# EAGLE schematic FootPlate_v1 (EAGLE 9.0.0)

## Sheet 1 of 5
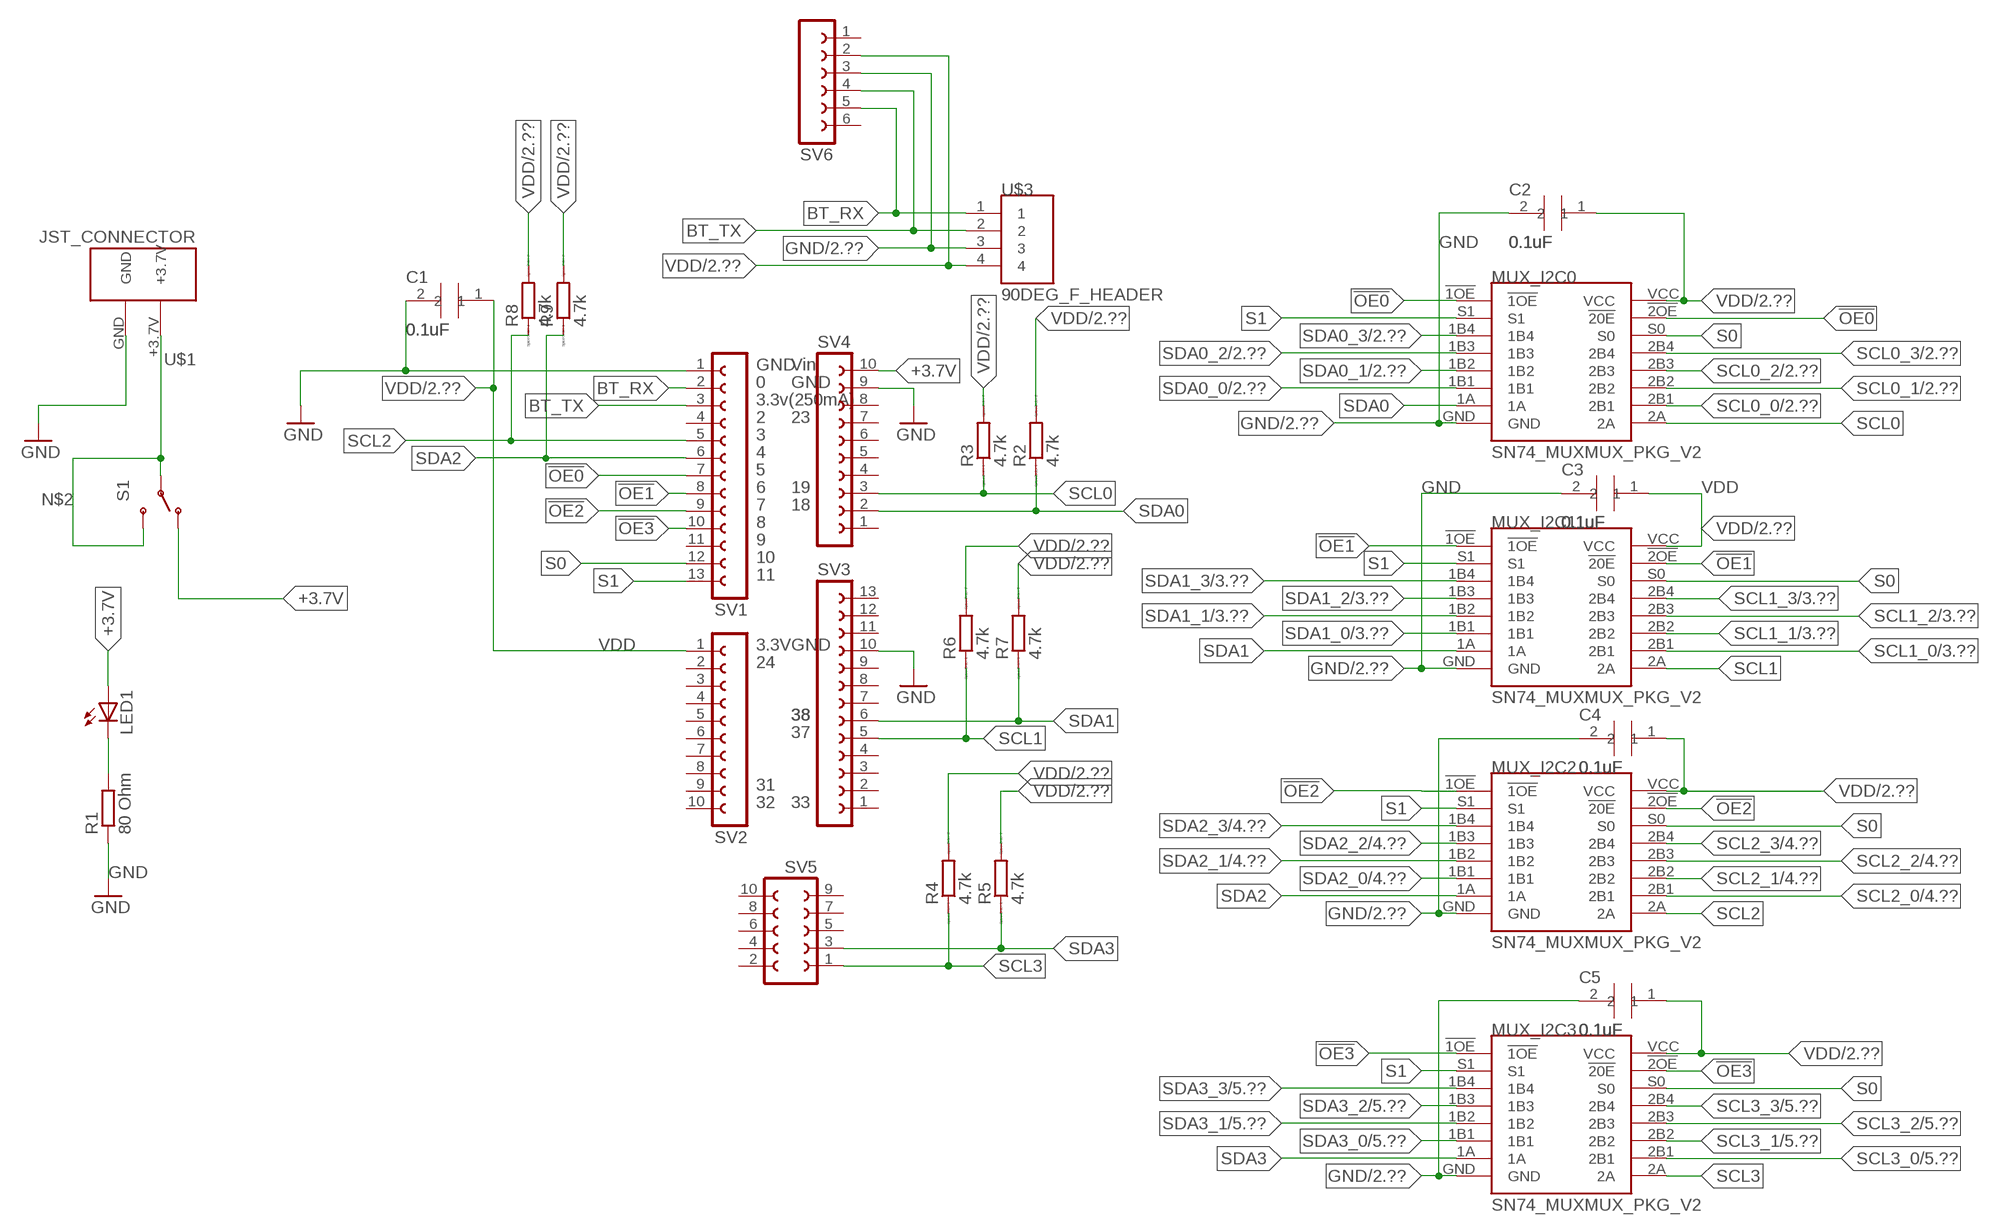
[diagram p0: schematic, sheet 1]

### Parts
C1  0.1uF  CAP  [CAPC1608X75]
C2  0.1uF  CAP  [CAPC1608X75]
C3  0.1uF  CAP  [CAPC1608X75]
C4  0.1uF  CAP  [CAPC1608X75]
C5  0.1uF  CAP  [CAPC1608X75]
LED1  LEDSMT1206  [1206]
MUX_I2C0  SN74_MUXMUX_PKG_V2  [SOP65P640X120-16]
MUX_I2C1  SN74_MUXMUX_PKG_V2  [SOP65P640X120-16]
MUX_I2C2  SN74_MUXMUX_PKG_V2  [SOP65P640X120-16]
MUX_I2C3  SN74_MUXMUX_PKG_V2  [SOP65P640X120-16]
R1  80 Ohm  R-EU_M1206  [M1206]
R2  4.7k  RR1206  [R1206]
R3  4.7k  RR1206  [R1206]
R4  4.7k  RR1206  [R1206]
R5  4.7k  RR1206  [R1206]
R6  4.7k  RR1206  [R1206]
R7  4.7k  RR1206  [R1206]
R8  4.7k  RR1206  [R1206]
R9  4.7k  RR1206  [R1206]
S1  SWITCH_SPDT  [SWITCH]
SV1  FE13-1  [FE13]
SV2  FE10-1  [FE10]
SV3  FE13-1  [FE13]
SV4  FE10-1  [FE10]
SV5  FE05-2  [FE05-2]
SV6  FE06-1  [FE06]
U$1  JST_CONNECTOR  [JST_PKG]
U$3  90DEG_F_HEADER  [90DEG_F_HEADER_PKG]

### Nets
!OE0: MUX_I2C0.!1OE MUX_I2C0.!2OE(!20E) SV1.7
!OE1: MUX_I2C1.!1OE MUX_I2C1.!2OE(!20E) SV1.8
!OE2: MUX_I2C2.!1OE MUX_I2C2.!2OE(!20E) SV1.9
!OE3: MUX_I2C3.!1OE MUX_I2C3.!2OE(!20E) SV1.10
+3.7V: LED1.A S1.1(O) SV4.10
BT_RX: SV1.2 SV6.5 U$3.1
BT_TX: SV1.3 SV6.4 U$3.2
GND: C1.2 C2.2 C3.2 C4.2 C5.2 MUX_I2C0.GND MUX_I2C1.GND MUX_I2C2.GND MUX_I2C3.GND R1.1 SV1.1 SV3.10 SV4.9 SV6.3 U$1.GND U$3.3 ; also sheet 2,3,4,5
N$1: LED1.C R1.2
N$2: S1.2(P) S1.3(S) U$1.+3.7V
S0: MUX_I2C0.S0 MUX_I2C1.S0 MUX_I2C2.S0 MUX_I2C3.S0 SV1.12
S1: MUX_I2C0.S1 MUX_I2C1.S1 MUX_I2C2.S1 MUX_I2C3.S1 SV1.13
SCL0: MUX_I2C0.2A R3.1 SV4.3
SCL0_0: MUX_I2C0.2B1 ; also sheet 2
SCL0_1: MUX_I2C0.2B2 ; also sheet 2
SCL0_2: MUX_I2C0.2B3 ; also sheet 2
SCL0_3: MUX_I2C0.2B4 ; also sheet 2
SCL1: MUX_I2C1.2A R6.1 SV3.5
SCL1_0: MUX_I2C1.2B1 ; also sheet 3
SCL1_1: MUX_I2C1.2B2 ; also sheet 3
SCL1_2: MUX_I2C1.2B3 ; also sheet 3
SCL1_3: MUX_I2C1.2B4 ; also sheet 3
SCL2: MUX_I2C2.2A R8.1 SV1.5
SCL2_0: MUX_I2C2.2B1 ; also sheet 4
SCL2_1: MUX_I2C2.2B2 ; also sheet 4
SCL2_2: MUX_I2C2.2B3 ; also sheet 4
SCL2_3: MUX_I2C2.2B4 ; also sheet 4
SCL3: MUX_I2C3.2A R4.1 SV5.1
SCL3_0: MUX_I2C3.2B1 ; also sheet 5
SCL3_1: MUX_I2C3.2B2 ; also sheet 5
SCL3_2: MUX_I2C3.2B3 ; also sheet 5
SCL3_3: MUX_I2C3.2B4 ; also sheet 5
SDA0: MUX_I2C0.1A R2.1 SV4.2
SDA0_0: MUX_I2C0.1B1 ; also sheet 2
SDA0_1: MUX_I2C0.1B2 ; also sheet 2
SDA0_2: MUX_I2C0.1B3 ; also sheet 2
SDA0_3: MUX_I2C0.1B4 ; also sheet 2
SDA1: MUX_I2C1.1A R7.1 SV3.6
SDA1_0: MUX_I2C1.1B1 ; also sheet 3
SDA1_1: MUX_I2C1.1B2 ; also sheet 3
SDA1_2: MUX_I2C1.1B3 ; also sheet 3
SDA1_3: MUX_I2C1.1B4 ; also sheet 3
SDA2: MUX_I2C2.1A R9.1 SV1.6
SDA2_0: MUX_I2C2.1B1 ; also sheet 4
SDA2_1: MUX_I2C2.1B2 ; also sheet 4
SDA2_2: MUX_I2C2.1B3 ; also sheet 4
SDA2_3: MUX_I2C2.1B4 ; also sheet 4
SDA3: MUX_I2C3.1A R5.1 SV5.3
SDA3_0: MUX_I2C3.1B1 ; also sheet 5
SDA3_1: MUX_I2C3.1B2 ; also sheet 5
SDA3_2: MUX_I2C3.1B3 ; also sheet 5
SDA3_3: MUX_I2C3.1B4 ; also sheet 5
VDD: C1.1 C2.1 C3.1 C4.1 C5.1 MUX_I2C0.VCC MUX_I2C1.VCC MUX_I2C2.VCC MUX_I2C3.VCC R2.2 R3.2 R4.2 R5.2 R6.2 R7.2 R8.2 R9.2 SV2.1 SV6.2 U$3.4 ; also sheet 2,3,4,5
Unconnected: SV1.4 SV1.11 SV2.2 SV2.3 SV2.4 SV2.5 SV2.6 SV2.7 SV2.8 SV2.9 SV2.10 SV3.1 SV3.2 SV3.3 SV3.4 SV3.7 SV3.8 SV3.9 SV3.11 SV3.12 SV3.13 SV4.1 SV4.4 SV4.5 SV4.6 SV4.7 SV4.8 SV5.2 SV5.4 SV5.5 SV5.6 SV5.7 SV5.8 SV5.9 SV5.10 SV6.1 SV6.6

### Notes on the sheet
- GND | Vin
- 0 | GND
- 3.3v(250mA)
- 2 | 23
- 3
- 4
- 5
- 6 | 19
- 7 | 18
- 8
- 9
- 10
- 11
- 3.3V | GND
- 24
- 38 | 38
- 37
- 31
- 32 | 33

## Sheet 2 of 5
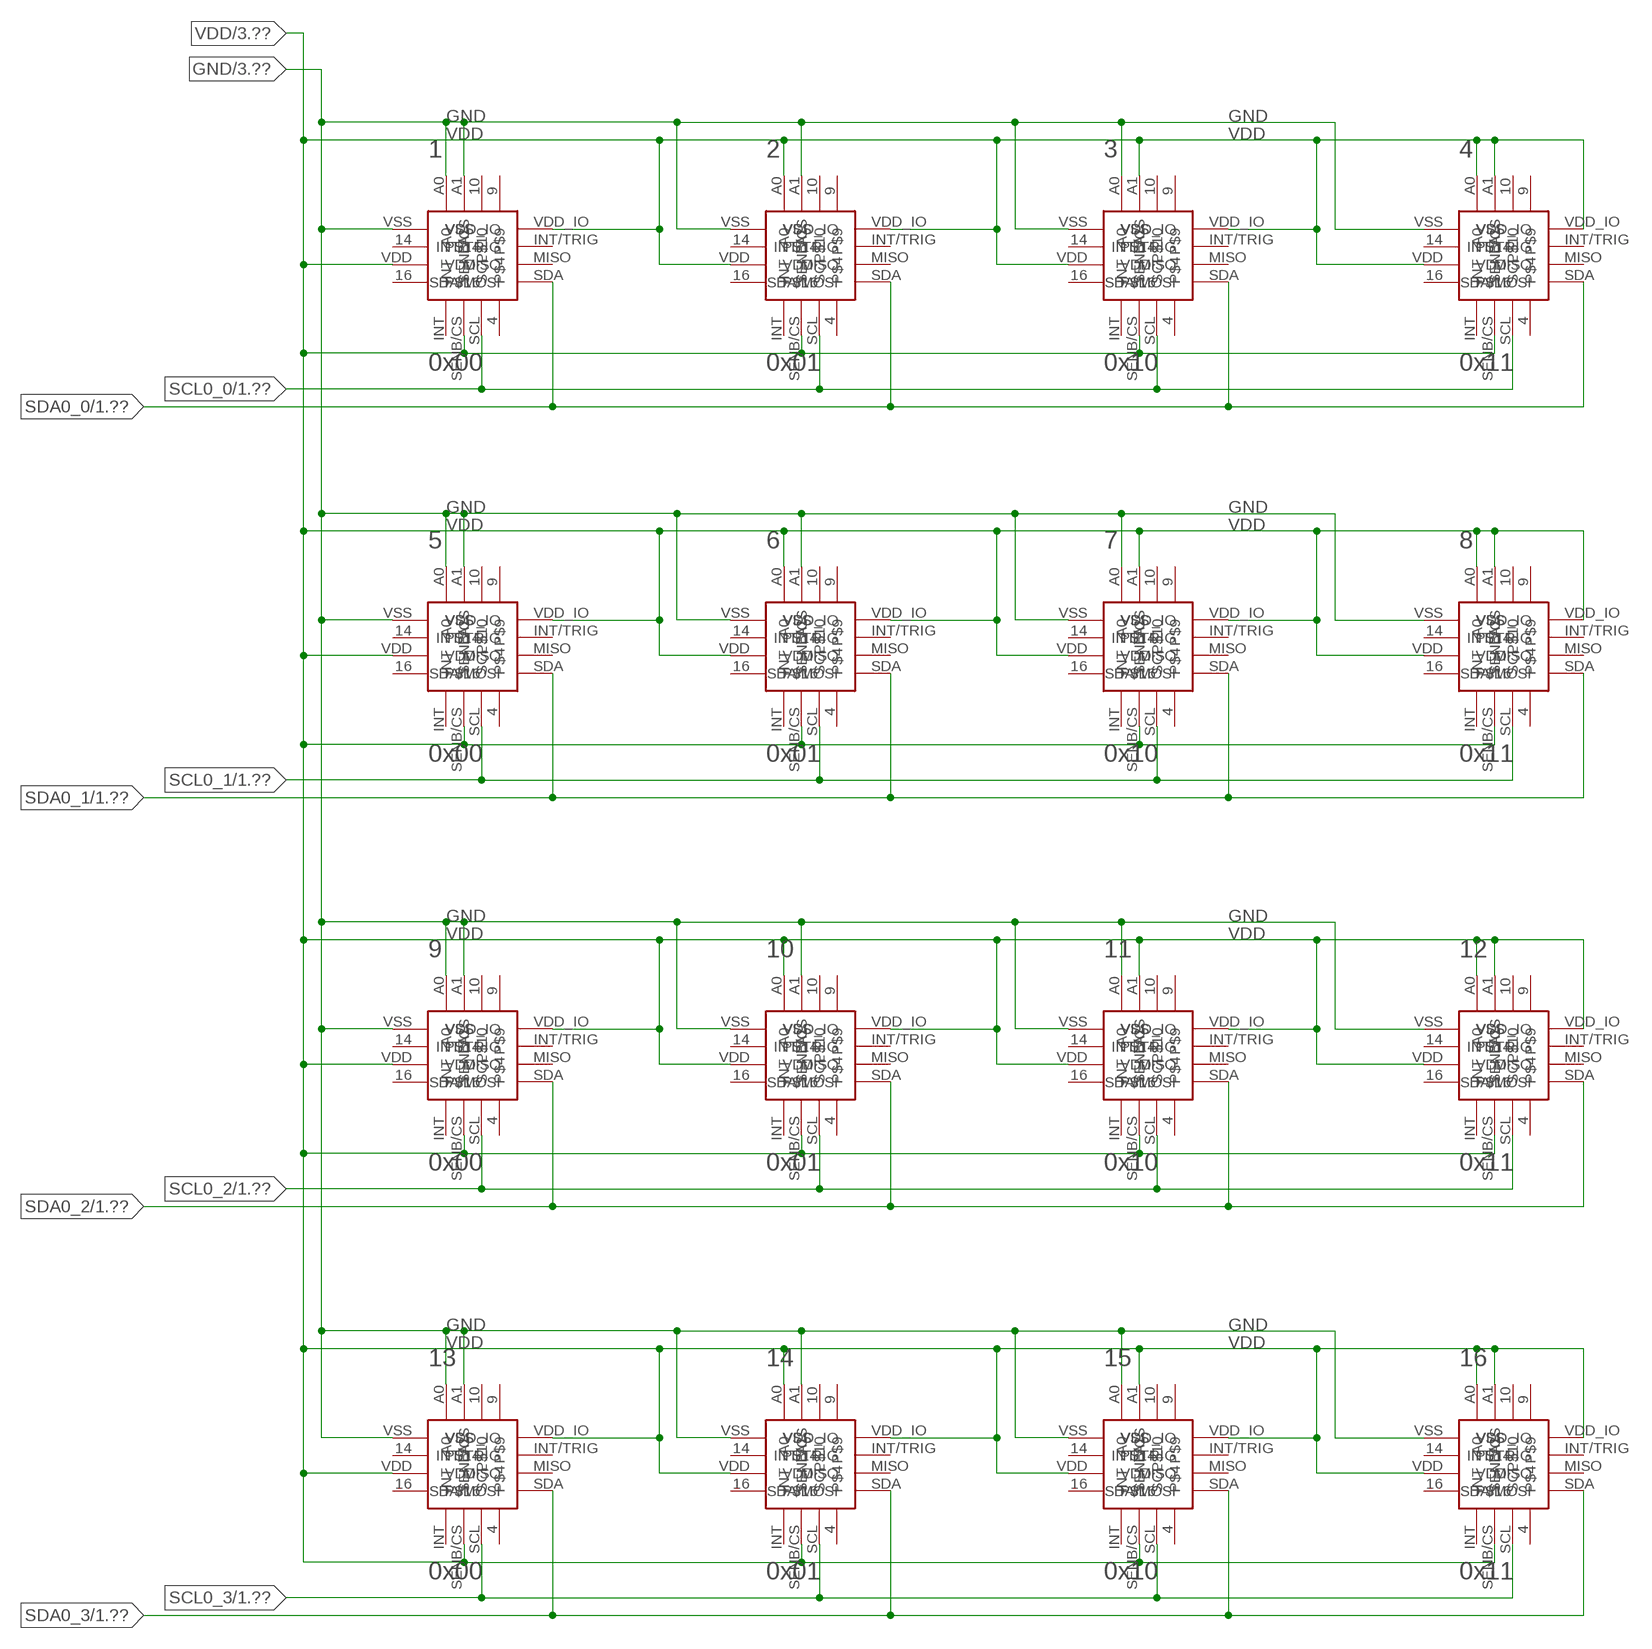
[diagram p1: schematic, sheet 2]

### Parts
1  0x00  ML90393_V2  [MLX90393_PKG]
2  0x01  ML90393_V2  [MLX90393_PKG]
3  0x10  ML90393_V2  [MLX90393_PKG]
4  0x11  ML90393_V2  [MLX90393_PKG]
5  0x00  ML90393_V2  [MLX90393_PKG]
6  0x01  ML90393_V2  [MLX90393_PKG]
7  0x10  ML90393_V2  [MLX90393_PKG]
8  0x11  ML90393_V2  [MLX90393_PKG]
9  0x00  ML90393_V2  [MLX90393_PKG]
10  0x01  ML90393_V2  [MLX90393_PKG]
11  0x10  ML90393_V2  [MLX90393_PKG]
12  0x11  ML90393_V2  [MLX90393_PKG]
13  0x00  ML90393_V2  [MLX90393_PKG]
14  0x01  ML90393_V2  [MLX90393_PKG]
15  0x10  ML90393_V2  [MLX90393_PKG]
16  0x11  ML90393_V2  [MLX90393_PKG]

### Nets
GND: 1.A0 1.A1 1.VSS 2.A1 2.VSS 3.A0 3.VSS 4.VSS 5.A0 5.A1 5.VSS 6.A1 6.VSS 7.A0 7.VSS 8.VSS 9.A0 9.A1 9.VSS 10.A1 10.VSS 11.A0 11.VSS 12.VSS 13.A0 13.A1 13.VSS 14.A1 14.VSS 15.A0 15.VSS 16.VSS ; also sheet 1,3,4,5
SCL0_0: 1.SCL 2.SCL 3.SCL 4.SCL ; also sheet 1
SCL0_1: 5.SCL 6.SCL 7.SCL 8.SCL ; also sheet 1
SCL0_2: 9.SCL 10.SCL 11.SCL 12.SCL ; also sheet 1
SCL0_3: 13.SCL 14.SCL 15.SCL 16.SCL ; also sheet 1
SDA0_0: 1.SDA(SDA/MOSI) 2.SDA(SDA/MOSI) 3.SDA(SDA/MOSI) 4.SDA(SDA/MOSI) ; also sheet 1
SDA0_1: 5.SDA(SDA/MOSI) 6.SDA(SDA/MOSI) 7.SDA(SDA/MOSI) 8.SDA(SDA/MOSI) ; also sheet 1
SDA0_2: 9.SDA(SDA/MOSI) 10.SDA(SDA/MOSI) 11.SDA(SDA/MOSI) 12.SDA(SDA/MOSI) ; also sheet 1
SDA0_3: 13.SDA(SDA/MOSI) 14.SDA(SDA/MOSI) 15.SDA(SDA/MOSI) 16.SDA(SDA/MOSI) ; also sheet 1
VDD: 1.SENB/CS 1.VDD 1.VDD_IO 2.A0 2.SENB/CS 2.VDD 2.VDD_IO 3.A1 3.SENB/CS 3.VDD 3.VDD_IO 4.A0 4.A1 4.SENB/CS 4.VDD 4.VDD_IO 5.SENB/CS 5.VDD 5.VDD_IO 6.A0 6.SENB/CS 6.VDD 6.VDD_IO 7.A1 7.SENB/CS 7.VDD 7.VDD_IO 8.A0 8.A1 8.SENB/CS 8.VDD 8.VDD_IO 9.SENB/CS 9.VDD 9.VDD_IO 10.A0 10.SENB/CS 10.VDD 10.VDD_IO 11.A1 11.SENB/CS 11.VDD 11.VDD_IO 12.A0 12.A1 12.SENB/CS 12.VDD 12.VDD_IO 13.SENB/CS 13.VDD 13.VDD_IO 14.A0 14.SENB/CS 14.VDD 14.VDD_IO 15.A1 15.SENB/CS 15.VDD 15.VDD_IO 16.A0 16.A1 16.SENB/CS 16.VDD 16.VDD_IO ; also sheet 1,3,4,5
Unconnected: 1.4 1.9 1.10 1.14 1.16 1.INT 1.INT/TRIG 1.MISO 2.4 2.9 2.10 2.14 2.16 2.INT 2.INT/TRIG 2.MISO 3.4 3.9 3.10 3.14 3.16 3.INT 3.INT/TRIG 3.MISO 4.4 4.9 4.10 4.14 4.16 4.INT 4.INT/TRIG 4.MISO 5.4 5.9 5.10 5.14 5.16 5.INT 5.INT/TRIG 5.MISO 6.4 6.9 6.10 6.14 6.16 6.INT 6.INT/TRIG 6.MISO 7.4 7.9 7.10 7.14 7.16 7.INT 7.INT/TRIG 7.MISO 8.4 8.9 8.10 8.14 8.16 8.INT 8.INT/TRIG 8.MISO 9.4 9.9 9.10 9.14 9.16 9.INT 9.INT/TRIG 9.MISO 10.4 10.9 10.10 10.14 10.16 10.INT 10.INT/TRIG 10.MISO 11.4 11.9 11.10 11.14 11.16 11.INT 11.INT/TRIG 11.MISO 12.4 12.9 12.10 12.14 12.16 12.INT 12.INT/TRIG 12.MISO 13.4 13.9 13.10 13.14 13.16 13.INT 13.INT/TRIG 13.MISO 14.4 14.9 14.10 14.14 14.16 14.INT 14.INT/TRIG 14.MISO 15.4 15.9 15.10 15.14 15.16 15.INT 15.INT/TRIG 15.MISO 16.4 16.9 16.10 16.14 16.16 16.INT 16.INT/TRIG 16.MISO

## Sheet 3 of 5
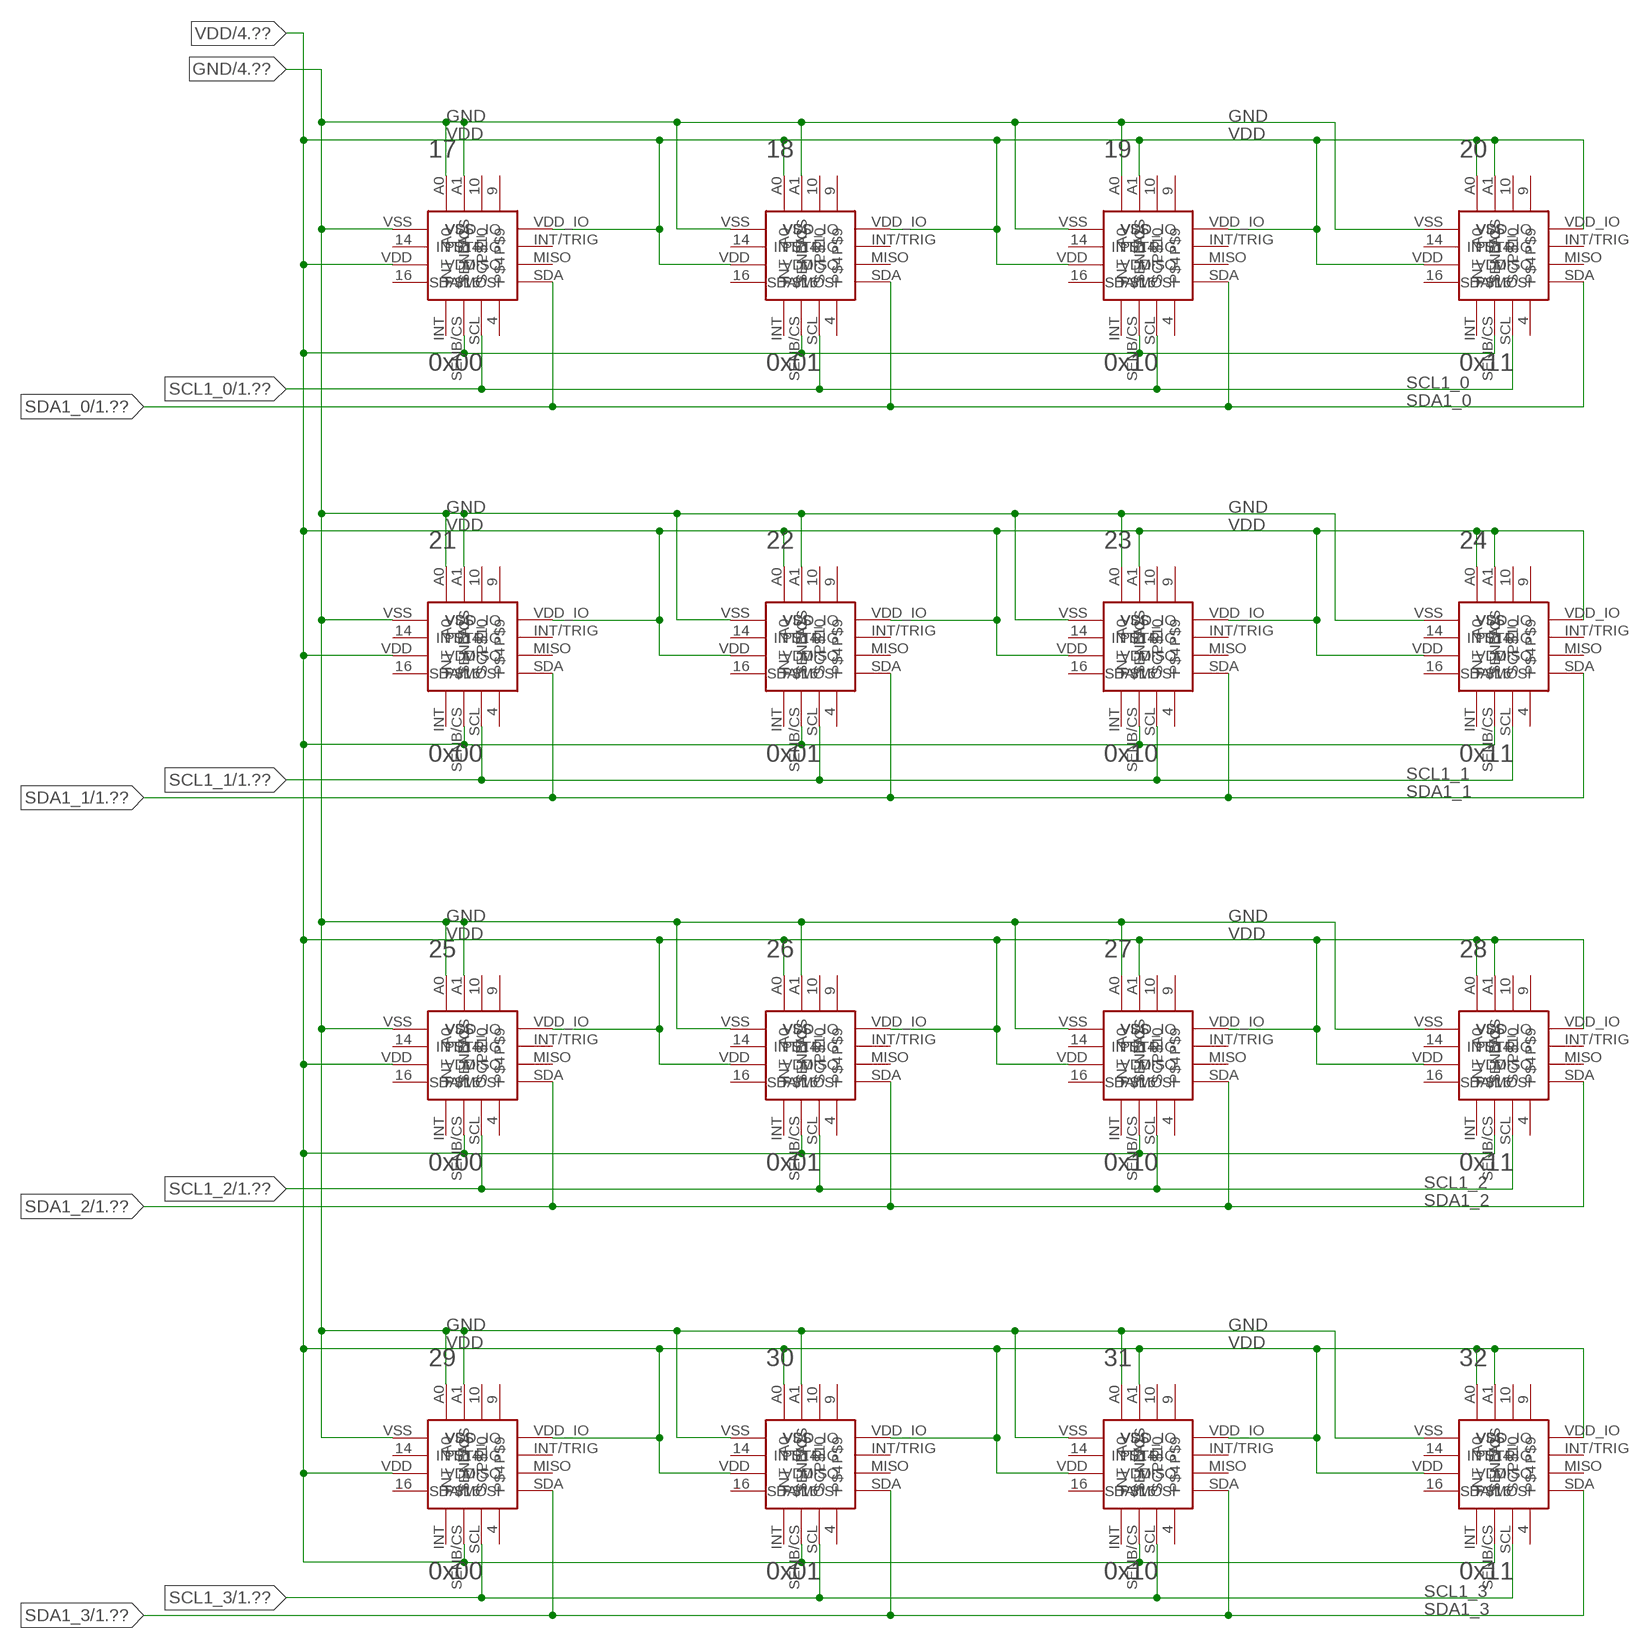
[diagram p2: schematic, sheet 3]

### Parts
17  0x00  ML90393_V2  [MLX90393_PKG]
18  0x01  ML90393_V2  [MLX90393_PKG]
19  0x10  ML90393_V2  [MLX90393_PKG]
20  0x11  ML90393_V2  [MLX90393_PKG]
21  0x00  ML90393_V2  [MLX90393_PKG]
22  0x01  ML90393_V2  [MLX90393_PKG]
23  0x10  ML90393_V2  [MLX90393_PKG]
24  0x11  ML90393_V2  [MLX90393_PKG]
25  0x00  ML90393_V2  [MLX90393_PKG]
26  0x01  ML90393_V2  [MLX90393_PKG]
27  0x10  ML90393_V2  [MLX90393_PKG]
28  0x11  ML90393_V2  [MLX90393_PKG]
29  0x00  ML90393_V2  [MLX90393_PKG]
30  0x01  ML90393_V2  [MLX90393_PKG]
31  0x10  ML90393_V2  [MLX90393_PKG]
32  0x11  ML90393_V2  [MLX90393_PKG]

### Nets
GND: 17.A0 17.A1 17.VSS 18.A1 18.VSS 19.A0 19.VSS 20.VSS 21.A0 21.A1 21.VSS 22.A1 22.VSS 23.A0 23.VSS 24.VSS 25.A0 25.A1 25.VSS 26.A1 26.VSS 27.A0 27.VSS 28.VSS 29.A0 29.A1 29.VSS 30.A1 30.VSS 31.A0 31.VSS 32.VSS ; also sheet 1,2,4,5
SCL1_0: 17.SCL 18.SCL 19.SCL 20.SCL ; also sheet 1
SCL1_1: 21.SCL 22.SCL 23.SCL 24.SCL ; also sheet 1
SCL1_2: 25.SCL 26.SCL 27.SCL 28.SCL ; also sheet 1
SCL1_3: 29.SCL 30.SCL 31.SCL 32.SCL ; also sheet 1
SDA1_0: 17.SDA(SDA/MOSI) 18.SDA(SDA/MOSI) 19.SDA(SDA/MOSI) 20.SDA(SDA/MOSI) ; also sheet 1
SDA1_1: 21.SDA(SDA/MOSI) 22.SDA(SDA/MOSI) 23.SDA(SDA/MOSI) 24.SDA(SDA/MOSI) ; also sheet 1
SDA1_2: 25.SDA(SDA/MOSI) 26.SDA(SDA/MOSI) 27.SDA(SDA/MOSI) 28.SDA(SDA/MOSI) ; also sheet 1
SDA1_3: 29.SDA(SDA/MOSI) 30.SDA(SDA/MOSI) 31.SDA(SDA/MOSI) 32.SDA(SDA/MOSI) ; also sheet 1
VDD: 17.SENB/CS 17.VDD 17.VDD_IO 18.A0 18.SENB/CS 18.VDD 18.VDD_IO 19.A1 19.SENB/CS 19.VDD 19.VDD_IO 20.A0 20.A1 20.SENB/CS 20.VDD 20.VDD_IO 21.SENB/CS 21.VDD 21.VDD_IO 22.A0 22.SENB/CS 22.VDD 22.VDD_IO 23.A1 23.SENB/CS 23.VDD 23.VDD_IO 24.A0 24.A1 24.SENB/CS 24.VDD 24.VDD_IO 25.SENB/CS 25.VDD 25.VDD_IO 26.A0 26.SENB/CS 26.VDD 26.VDD_IO 27.A1 27.SENB/CS 27.VDD 27.VDD_IO 28.A0 28.A1 28.SENB/CS 28.VDD 28.VDD_IO 29.SENB/CS 29.VDD 29.VDD_IO 30.A0 30.SENB/CS 30.VDD 30.VDD_IO 31.A1 31.SENB/CS 31.VDD 31.VDD_IO 32.A0 32.A1 32.SENB/CS 32.VDD 32.VDD_IO ; also sheet 1,2,4,5
Unconnected: 17.4 17.9 17.10 17.14 17.16 17.INT 17.INT/TRIG 17.MISO 18.4 18.9 18.10 18.14 18.16 18.INT 18.INT/TRIG 18.MISO 19.4 19.9 19.10 19.14 19.16 19.INT 19.INT/TRIG 19.MISO 20.4 20.9 20.10 20.14 20.16 20.INT 20.INT/TRIG 20.MISO 21.4 21.9 21.10 21.14 21.16 21.INT 21.INT/TRIG 21.MISO 22.4 22.9 22.10 22.14 22.16 22.INT 22.INT/TRIG 22.MISO 23.4 23.9 23.10 23.14 23.16 23.INT 23.INT/TRIG 23.MISO 24.4 24.9 24.10 24.14 24.16 24.INT 24.INT/TRIG 24.MISO 25.4 25.9 25.10 25.14 25.16 25.INT 25.INT/TRIG 25.MISO 26.4 26.9 26.10 26.14 26.16 26.INT 26.INT/TRIG 26.MISO 27.4 27.9 27.10 27.14 27.16 27.INT 27.INT/TRIG 27.MISO 28.4 28.9 28.10 28.14 28.16 28.INT 28.INT/TRIG 28.MISO 29.4 29.9 29.10 29.14 29.16 29.INT 29.INT/TRIG 29.MISO 30.4 30.9 30.10 30.14 30.16 30.INT 30.INT/TRIG 30.MISO 31.4 31.9 31.10 31.14 31.16 31.INT 31.INT/TRIG 31.MISO 32.4 32.9 32.10 32.14 32.16 32.INT 32.INT/TRIG 32.MISO

## Sheet 4 of 5
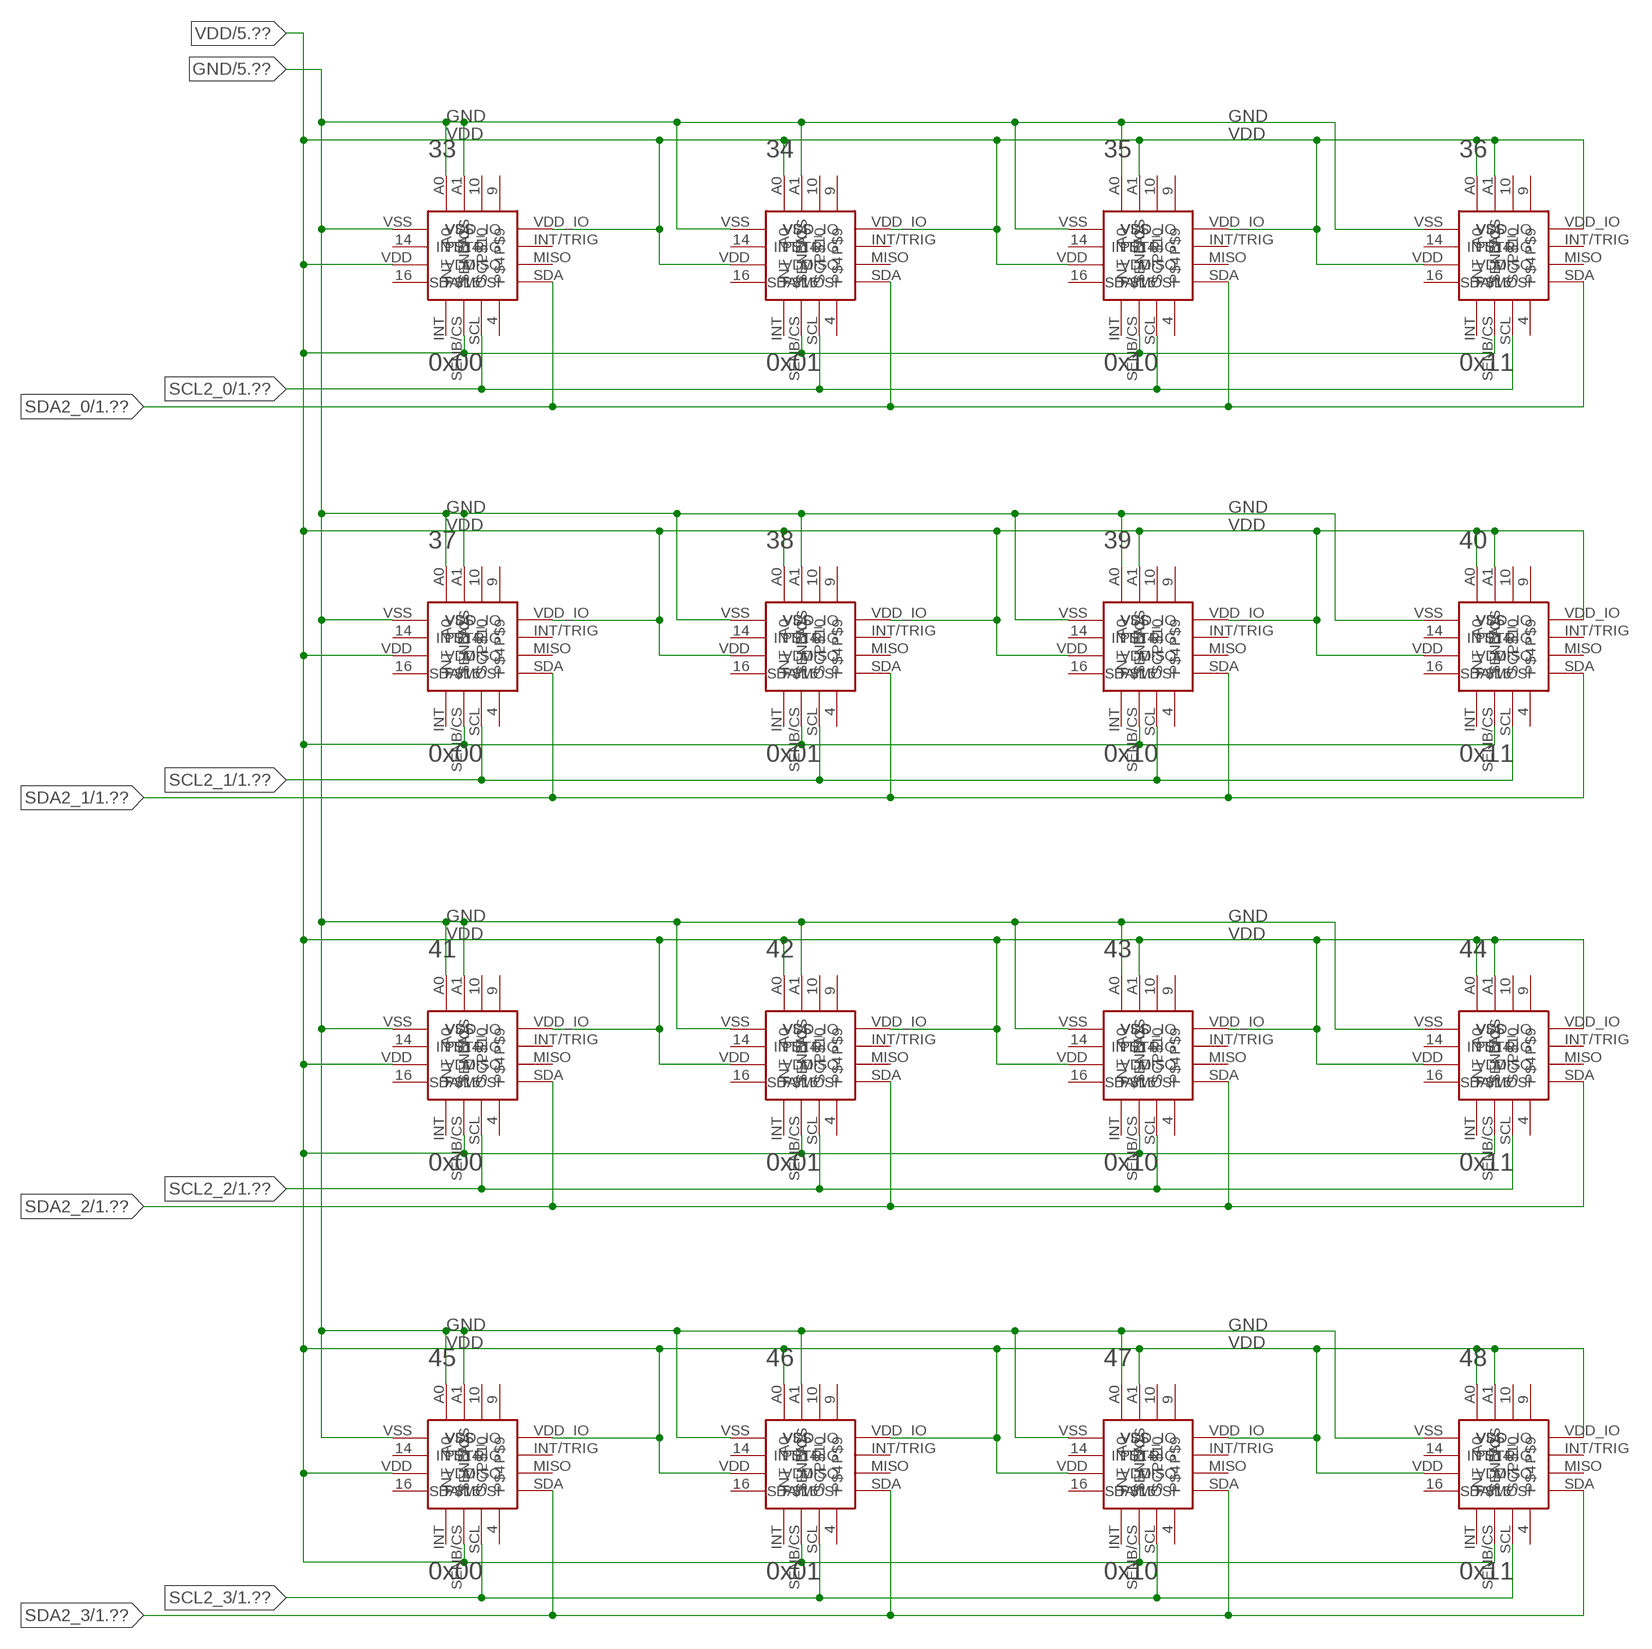
[diagram p3: schematic, sheet 4]

### Parts
33  0x00  ML90393_V2  [MLX90393_PKG]
34  0x01  ML90393_V2  [MLX90393_PKG]
35  0x10  ML90393_V2  [MLX90393_PKG]
36  0x11  ML90393_V2  [MLX90393_PKG]
37  0x00  ML90393_V2  [MLX90393_PKG]
38  0x01  ML90393_V2  [MLX90393_PKG]
39  0x10  ML90393_V2  [MLX90393_PKG]
40  0x11  ML90393_V2  [MLX90393_PKG]
41  0x00  ML90393_V2  [MLX90393_PKG]
42  0x01  ML90393_V2  [MLX90393_PKG]
43  0x10  ML90393_V2  [MLX90393_PKG]
44  0x11  ML90393_V2  [MLX90393_PKG]
45  0x00  ML90393_V2  [MLX90393_PKG]
46  0x01  ML90393_V2  [MLX90393_PKG]
47  0x10  ML90393_V2  [MLX90393_PKG]
48  0x11  ML90393_V2  [MLX90393_PKG]

### Nets
GND: 33.A0 33.A1 33.VSS 34.A1 34.VSS 35.A0 35.VSS 36.VSS 37.A0 37.A1 37.VSS 38.A1 38.VSS 39.A0 39.VSS 40.VSS 41.A0 41.A1 41.VSS 42.A1 42.VSS 43.A0 43.VSS 44.VSS 45.A0 45.A1 45.VSS 46.A1 46.VSS 47.A0 47.VSS 48.VSS ; also sheet 1,2,3,5
SCL2_0: 33.SCL 34.SCL 35.SCL 36.SCL ; also sheet 1
SCL2_1: 37.SCL 38.SCL 39.SCL 40.SCL ; also sheet 1
SCL2_2: 41.SCL 42.SCL 43.SCL 44.SCL ; also sheet 1
SCL2_3: 45.SCL 46.SCL 47.SCL 48.SCL ; also sheet 1
SDA2_0: 33.SDA(SDA/MOSI) 34.SDA(SDA/MOSI) 35.SDA(SDA/MOSI) 36.SDA(SDA/MOSI) ; also sheet 1
SDA2_1: 37.SDA(SDA/MOSI) 38.SDA(SDA/MOSI) 39.SDA(SDA/MOSI) 40.SDA(SDA/MOSI) ; also sheet 1
SDA2_2: 41.SDA(SDA/MOSI) 42.SDA(SDA/MOSI) 43.SDA(SDA/MOSI) 44.SDA(SDA/MOSI) ; also sheet 1
SDA2_3: 45.SDA(SDA/MOSI) 46.SDA(SDA/MOSI) 47.SDA(SDA/MOSI) 48.SDA(SDA/MOSI) ; also sheet 1
VDD: 33.SENB/CS 33.VDD 33.VDD_IO 34.A0 34.SENB/CS 34.VDD 34.VDD_IO 35.A1 35.SENB/CS 35.VDD 35.VDD_IO 36.A0 36.A1 36.SENB/CS 36.VDD 36.VDD_IO 37.SENB/CS 37.VDD 37.VDD_IO 38.A0 38.SENB/CS 38.VDD 38.VDD_IO 39.A1 39.SENB/CS 39.VDD 39.VDD_IO 40.A0 40.A1 40.SENB/CS 40.VDD 40.VDD_IO 41.SENB/CS 41.VDD 41.VDD_IO 42.A0 42.SENB/CS 42.VDD 42.VDD_IO 43.A1 43.SENB/CS 43.VDD 43.VDD_IO 44.A0 44.A1 44.SENB/CS 44.VDD 44.VDD_IO 45.SENB/CS 45.VDD 45.VDD_IO 46.A0 46.SENB/CS 46.VDD 46.VDD_IO 47.A1 47.SENB/CS 47.VDD 47.VDD_IO 48.A0 48.A1 48.SENB/CS 48.VDD 48.VDD_IO ; also sheet 1,2,3,5
Unconnected: 33.4 33.9 33.10 33.14 33.16 33.INT 33.INT/TRIG 33.MISO 34.4 34.9 34.10 34.14 34.16 34.INT 34.INT/TRIG 34.MISO 35.4 35.9 35.10 35.14 35.16 35.INT 35.INT/TRIG 35.MISO 36.4 36.9 36.10 36.14 36.16 36.INT 36.INT/TRIG 36.MISO 37.4 37.9 37.10 37.14 37.16 37.INT 37.INT/TRIG 37.MISO 38.4 38.9 38.10 38.14 38.16 38.INT 38.INT/TRIG 38.MISO 39.4 39.9 39.10 39.14 39.16 39.INT 39.INT/TRIG 39.MISO 40.4 40.9 40.10 40.14 40.16 40.INT 40.INT/TRIG 40.MISO 41.4 41.9 41.10 41.14 41.16 41.INT 41.INT/TRIG 41.MISO 42.4 42.9 42.10 42.14 42.16 42.INT 42.INT/TRIG 42.MISO 43.4 43.9 43.10 43.14 43.16 43.INT 43.INT/TRIG 43.MISO 44.4 44.9 44.10 44.14 44.16 44.INT 44.INT/TRIG 44.MISO 45.4 45.9 45.10 45.14 45.16 45.INT 45.INT/TRIG 45.MISO 46.4 46.9 46.10 46.14 46.16 46.INT 46.INT/TRIG 46.MISO 47.4 47.9 47.10 47.14 47.16 47.INT 47.INT/TRIG 47.MISO 48.4 48.9 48.10 48.14 48.16 48.INT 48.INT/TRIG 48.MISO

## Sheet 5 of 5
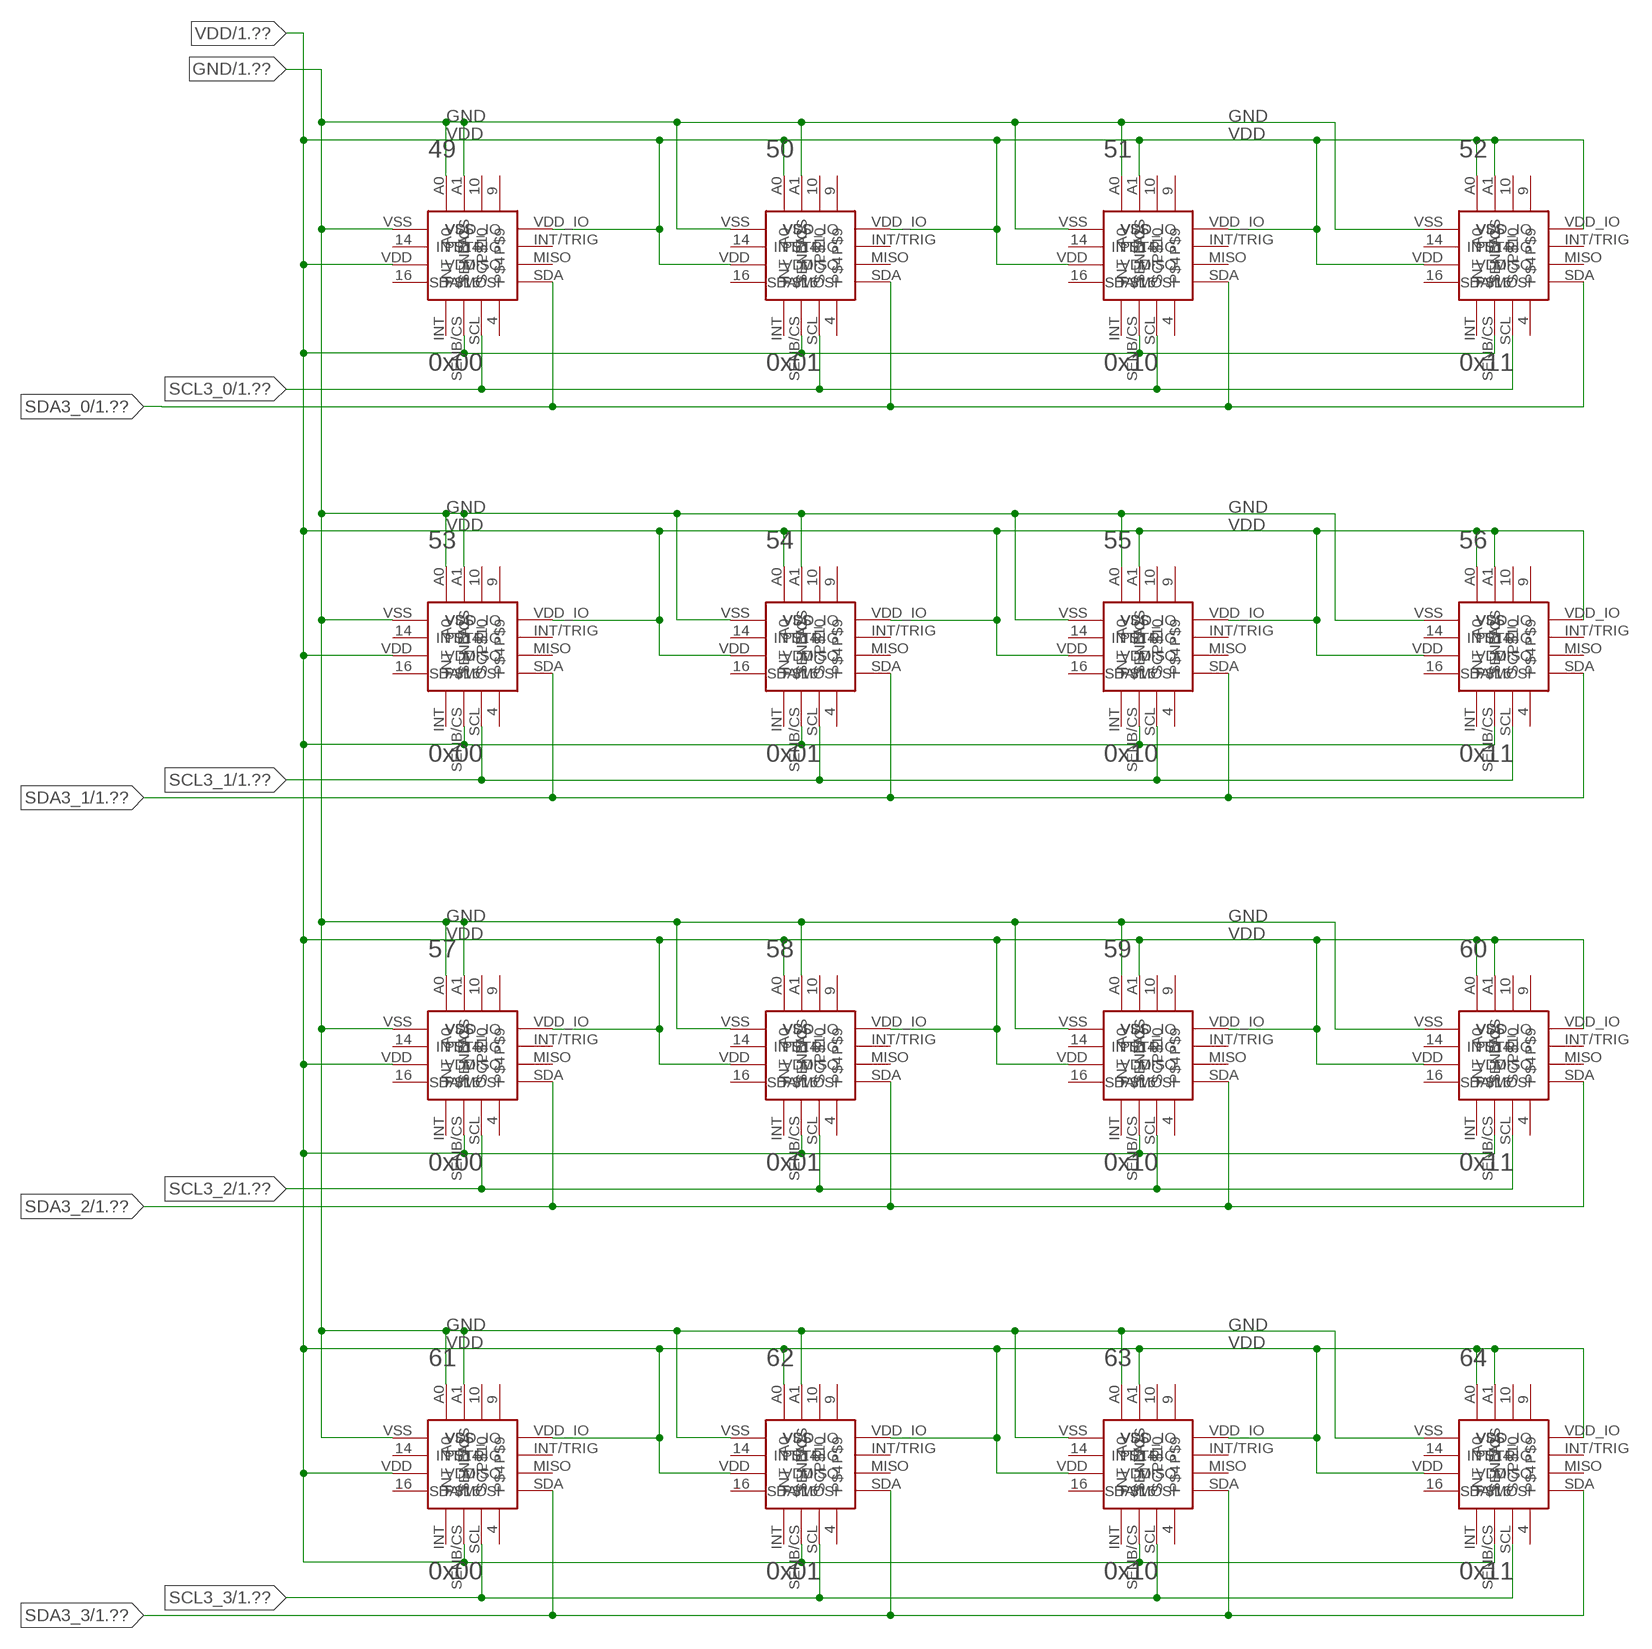
[diagram p4: schematic, sheet 5]

### Parts
49  0x00  ML90393_V2  [MLX90393_PKG]
50  0x01  ML90393_V2  [MLX90393_PKG]
51  0x10  ML90393_V2  [MLX90393_PKG]
52  0x11  ML90393_V2  [MLX90393_PKG]
53  0x00  ML90393_V2  [MLX90393_PKG]
54  0x01  ML90393_V2  [MLX90393_PKG]
55  0x10  ML90393_V2  [MLX90393_PKG]
56  0x11  ML90393_V2  [MLX90393_PKG]
57  0x00  ML90393_V2  [MLX90393_PKG]
58  0x01  ML90393_V2  [MLX90393_PKG]
59  0x10  ML90393_V2  [MLX90393_PKG]
60  0x11  ML90393_V2  [MLX90393_PKG]
61  0x00  ML90393_V2  [MLX90393_PKG]
62  0x01  ML90393_V2  [MLX90393_PKG]
63  0x10  ML90393_V2  [MLX90393_PKG]
64  0x11  ML90393_V2  [MLX90393_PKG]

### Nets
GND: 49.A0 49.A1 49.VSS 50.A1 50.VSS 51.A0 51.VSS 52.VSS 53.A0 53.A1 53.VSS 54.A1 54.VSS 55.A0 55.VSS 56.VSS 57.A0 57.A1 57.VSS 58.A1 58.VSS 59.A0 59.VSS 60.VSS 61.A0 61.A1 61.VSS 62.A1 62.VSS 63.A0 63.VSS 64.VSS ; also sheet 1,2,3,4
SCL3_0: 49.SCL 50.SCL 51.SCL 52.SCL ; also sheet 1
SCL3_1: 53.SCL 54.SCL 55.SCL 56.SCL ; also sheet 1
SCL3_2: 57.SCL 58.SCL 59.SCL 60.SCL ; also sheet 1
SCL3_3: 61.SCL 62.SCL 63.SCL 64.SCL ; also sheet 1
SDA3_0: 49.SDA(SDA/MOSI) 50.SDA(SDA/MOSI) 51.SDA(SDA/MOSI) 52.SDA(SDA/MOSI) ; also sheet 1
SDA3_1: 53.SDA(SDA/MOSI) 54.SDA(SDA/MOSI) 55.SDA(SDA/MOSI) 56.SDA(SDA/MOSI) ; also sheet 1
SDA3_2: 57.SDA(SDA/MOSI) 58.SDA(SDA/MOSI) 59.SDA(SDA/MOSI) 60.SDA(SDA/MOSI) ; also sheet 1
SDA3_3: 61.SDA(SDA/MOSI) 62.SDA(SDA/MOSI) 63.SDA(SDA/MOSI) 64.SDA(SDA/MOSI) ; also sheet 1
VDD: 49.SENB/CS 49.VDD 49.VDD_IO 50.A0 50.SENB/CS 50.VDD 50.VDD_IO 51.A1 51.SENB/CS 51.VDD 51.VDD_IO 52.A0 52.A1 52.SENB/CS 52.VDD 52.VDD_IO 53.SENB/CS 53.VDD 53.VDD_IO 54.A0 54.SENB/CS 54.VDD 54.VDD_IO 55.A1 55.SENB/CS 55.VDD 55.VDD_IO 56.A0 56.A1 56.SENB/CS 56.VDD 56.VDD_IO 57.SENB/CS 57.VDD 57.VDD_IO 58.A0 58.SENB/CS 58.VDD 58.VDD_IO 59.A1 59.SENB/CS 59.VDD 59.VDD_IO 60.A0 60.A1 60.SENB/CS 60.VDD 60.VDD_IO 61.SENB/CS 61.VDD 61.VDD_IO 62.A0 62.SENB/CS 62.VDD 62.VDD_IO 63.A1 63.SENB/CS 63.VDD 63.VDD_IO 64.A0 64.A1 64.SENB/CS 64.VDD 64.VDD_IO ; also sheet 1,2,3,4
Unconnected: 49.4 49.9 49.10 49.14 49.16 49.INT 49.INT/TRIG 49.MISO 50.4 50.9 50.10 50.14 50.16 50.INT 50.INT/TRIG 50.MISO 51.4 51.9 51.10 51.14 51.16 51.INT 51.INT/TRIG 51.MISO 52.4 52.9 52.10 52.14 52.16 52.INT 52.INT/TRIG 52.MISO 53.4 53.9 53.10 53.14 53.16 53.INT 53.INT/TRIG 53.MISO 54.4 54.9 54.10 54.14 54.16 54.INT 54.INT/TRIG 54.MISO 55.4 55.9 55.10 55.14 55.16 55.INT 55.INT/TRIG 55.MISO 56.4 56.9 56.10 56.14 56.16 56.INT 56.INT/TRIG 56.MISO 57.4 57.9 57.10 57.14 57.16 57.INT 57.INT/TRIG 57.MISO 58.4 58.9 58.10 58.14 58.16 58.INT 58.INT/TRIG 58.MISO 59.4 59.9 59.10 59.14 59.16 59.INT 59.INT/TRIG 59.MISO 60.4 60.9 60.10 60.14 60.16 60.INT 60.INT/TRIG 60.MISO 61.4 61.9 61.10 61.14 61.16 61.INT 61.INT/TRIG 61.MISO 62.4 62.9 62.10 62.14 62.16 62.INT 62.INT/TRIG 62.MISO 63.4 63.9 63.10 63.14 63.16 63.INT 63.INT/TRIG 63.MISO 64.4 64.9 64.10 64.14 64.16 64.INT 64.INT/TRIG 64.MISO

## Library data of the parts
1-64 = FootPlate:ML90393_V2
C1-C5 = FootPlate:CAP
LED1 = led:LED: LED OSRAM: - CHIPLED LG R971, LG N971, LY N971, LG Q971, LY Q971, LO R971, LY R971 LH N974, LH R974 LS Q976, LO Q976, LY Q976 LO Q996 - Hyper CHIPLED LW Q18S LB Q993, LB Q99A, LB R99A - SideLED LS A670, LO A670, LY A670, LG A670, LP A670 LB A673, LV A673, LT A673, LW A673 LH A674 LY A675 LS A676, LA A676, LO A676, LY A676, LW A676 LS A679, LY A679, LG A679 - Hyper Micro SIDELED® LS Y876, LA Y876, LO Y876, LY Y876 LT Y87S - SmartLED LW L88C, LW L88S LB L89C, LB L89S, LG L890 LS L89K, LO L89K, LY L89K LS L896, LA L896, LO L896, LY L896 - TOPLED LS T670, LO T670, LY T670, LG T670, LP T670 LSG T670, LSP T670, LSY T670, LOP T670, LYG T670 LG T671, LOG T671, LSG T671 LB T673, LV T673, LT T673, LW T673 LH T674 LS T676, LA T676, LO T676, LY T676, LB T676, LH T676, LSB T676, LW T676 LB T67C, LV T67C, LT T67C, LS T67K, LO T67K, LY T67K, LW E67C LS E67B, LA E67B, LO E67B, LY E67B, LB E67C, LV E67C, LT E67C LW T67C LS T679, LY T679, LG T679 LS T770, LO T770, LY T770, LG T770, LP T770 LB T773, LV T773, LT T773, LW T773 LH T774 LS E675, LA E675, LY E675, LS T675 LS T776, LA T776, LO T776, LY T776, LB T776 LHGB T686 LT T68C, LB T68C - Hyper Mini TOPLED® LB M676 - Mini TOPLED Santana® LG M470 LS M47K, LO M47K, LY M47K Source: http://www.osram.convergy.de LUXEON: - LUMILED® LXK2-PW12-R00, LXK2-PW12-S00, LXK2-PW14-U00, LXK2-PW14-V00 LXK2-PM12-R00, LXK2-PM12-S00, LXK2-PM14-U00 LXK2-PE12-Q00, LXK2-PE12-R00, LXK2-PE12-S00, LXK2-PE14-T00, LXK2-PE14-U00 LXK2-PB12-K00, LXK2-PB12-L00, LXK2-PB12-M00, LXK2-PB14-N00, LXK2-PB14-P00, LXK2-PB14-Q00 LXK2-PR12-L00, LXK2-PR12-M00, LXK2-PR14-Q00, LXK2-PR14-R00 LXK2-PD12-Q00, LXK2-PD12-R00, LXK2-PD12-S00 LXK2-PH12-R00, LXK2-PH12-S00 LXK2-PL12-P00, LXK2-PL12-Q00, LXK2-PL12-R00 Source: www.luxeon.com KINGBRIGHT: KA-3528ASYC Source: www.kingbright.com
MUX_I2C0 MUX_I2C1-MUX_I2C3 = FootPlate:SN74_MUX
R1 = resistor:R-EU_: RESISTOR, European symbol
R2-R9 = eagle-ltspice:R: RESISTOR, European symbol; SPICEMODEL: NONE; SPICEPREFIX: R
S1 = GamePad:SWITCH: Slide-switch - SPDT [Rapid Electronics - 76-0200]
SV1 SV3 = con-lsta:FE13-1: FEMALE HEADER; OC_FARNELL: unknown; OC_NEWARK: unknown
SV2 SV4 = con-lsta:FE10-1: FEMALE HEADER; OC_FARNELL: unknown; OC_NEWARK: unknown
SV5 = con-lsta:FE05-2: FEMALE HEADER; OC_FARNELL: unknown; OC_NEWARK: unknown
SV6 = con-lsta:FE06-1: FEMALE HEADER; OC_FARNELL: unknown; OC_NEWARK: unknown
U$1 = FootPlate:JST_CONNECTOR
U$3 = FootPlate:90DEG_F_HEADER